# EAGLE schematic Main 4000 Model REV1A (EAGLE 7.4.0)

## Sheet 1 of 4: PWR
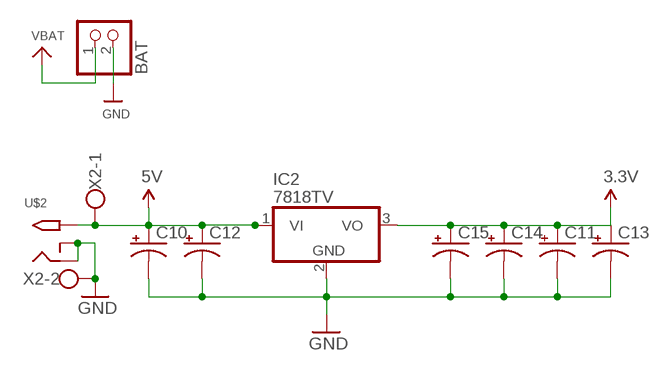
[diagram p0: schematic, sheet 1]

### Parts
BAT  JST_2PIN-SMT-RA  [JST-PH-2-SMT-RA]
C10  CPOL-USE2.5-6  [E2,5-6]
C11  CPOL-USE1.8-4  [E1,8-4]
C12  CPOL-USE1.8-4  [E1,8-4]
C13  CPOL-USE2.5-6  [E2,5-6]
C14  CPOL-USE1.8-4  [E1,8-4]
C15  CPOL-USE1.8-4  [E1,8-4]
IC2  7818TV  [TO220V]
U$2  2.1MMJACKTHM  [PJ-102A]
X2  W237-102  [W237-102]

### Nets
3.3V: C11.+ C13.+ C14.+ C15.+ IC2.3(VO) ; also sheet 2,3,4
5V: C10.+ C12.+ IC2.1(VI) U$2.TIP X2.1 ; also sheet 2,3,4
GND: BAT.2 C10.- C11.- C12.- C13.- C14.- C15.- IC2.2(GND) U$2.RING U$2.RING_SW X2.2 ; also sheet 2,3,4
VBAT: BAT.1 ; also sheet 2,3,4

## Sheet 2 of 4: Connectors and Coms
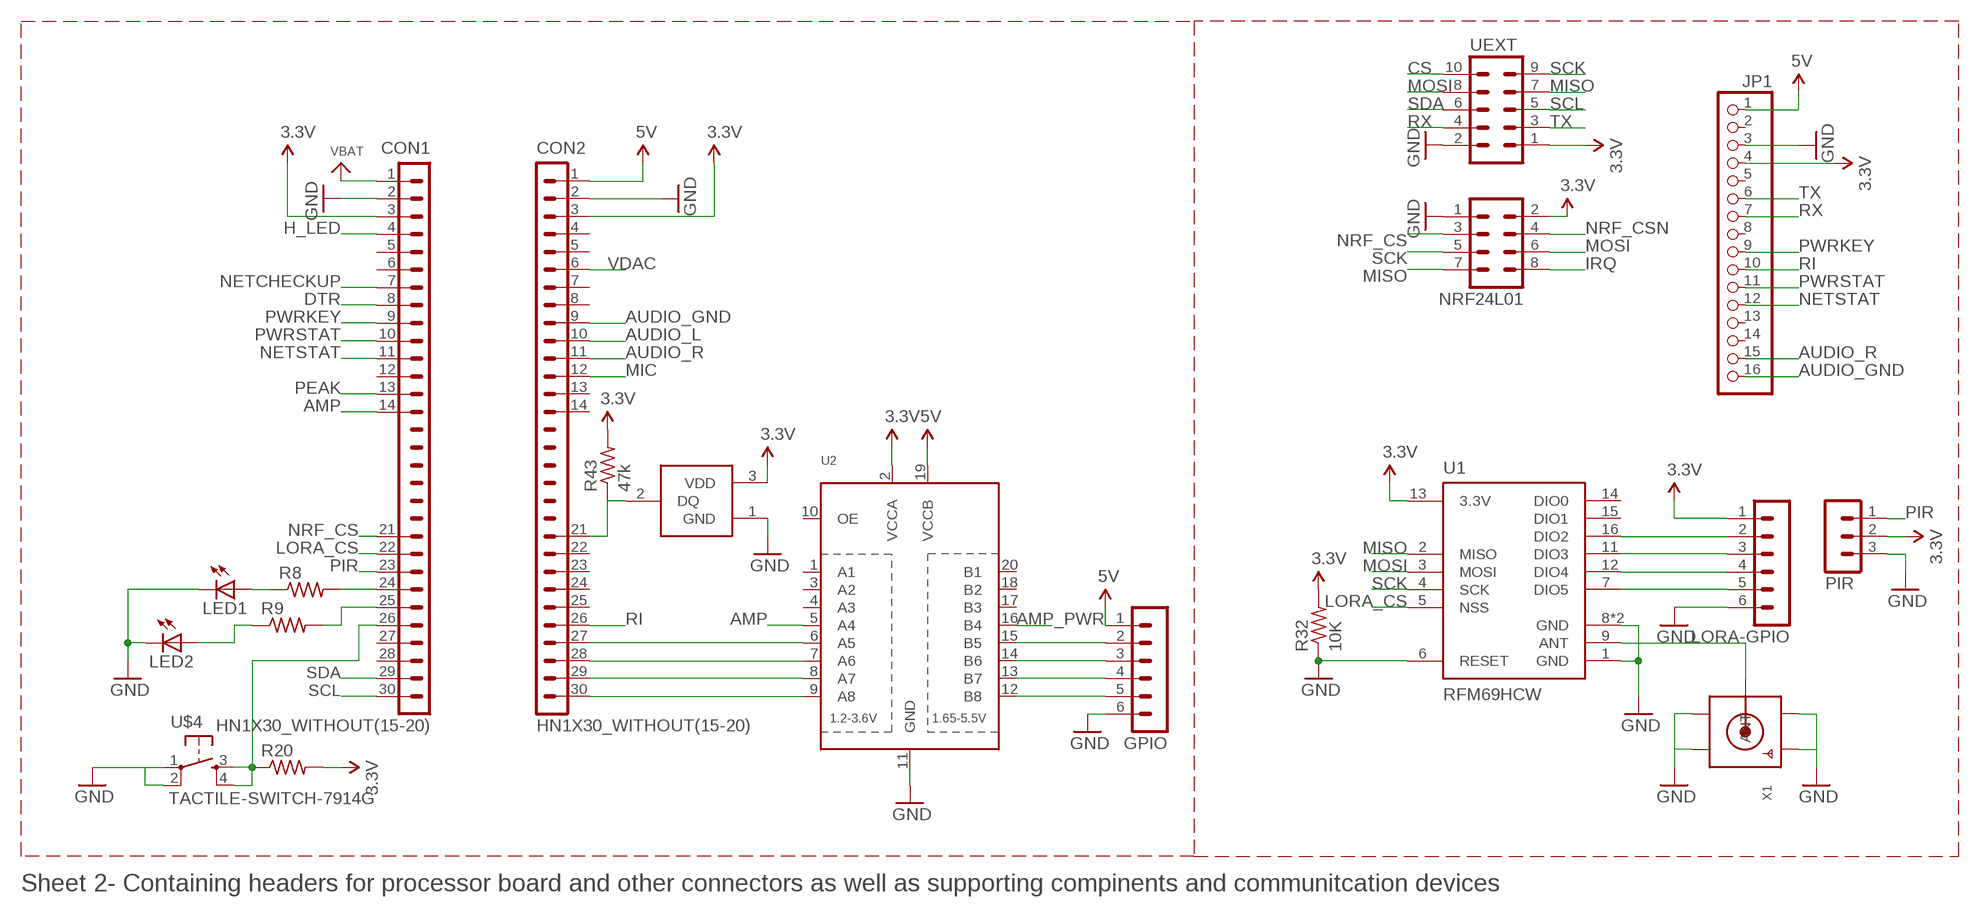
[diagram p1: schematic, sheet 2]

### Parts
CON1  HN1X30_WITHOUT(15-20)  CON30_WITHOUT(15-20)  [HN1X30_WITHOUT(15-20)]
CON2  HN1X30_WITHOUT(15-20)  CON30_WITHOUT(15-20)  [HN1X30_WITHOUT(15-20)]
GPIO  MA06-1  [MA06-1]
JP1  PINHD-1X16  [1X16]
LED1  LED5MM  [LED5MM]
LED2  LED5MM  [LED5MM]
LORA-GPIO  MA06-1  [MA06-1]
NRF24L01  MA04-2  [MA04-2]
PIR  MA03-1  [MA03-1]
R8  R-US_R0805  [R0805]
R9  R-US_R0805  [R0805]
R20  R-US_R0805  [R0805]
R32  10K  R-US_R0805  [R0805]
R43  47k  R-US_R0805  [R0805]
U1  RFM69HCW  [RFM69HCW-XXXS2]
U2  TXB0108PWR  [TSSOP20]
U$4  TACTILE-SWITCH-7914G  [7914G]
U$11  DS18B20Z  [TO92]
UEXT  MA05-2  [MA05-2]
X1  SMACONNECTOR_EDGE  [SMA_EDGELAUNCH]

### Nets
3.3V: CON1.3 CON2.3 JP1.4 LORA-GPIO.1 NRF24L01.2 PIR.2 R20.2 R32.2 R43.2 U1.13(3.3V) U2.2(VCCA) U$11.3(VDD) UEXT.1 ; also sheet 1,3,4
5V: CON2.1 GPIO.1 JP1.1 U2.19(VCCB) ; also sheet 1,3,4
AMP: CON1.14 U2.5(A4)
AMP_PWR: U2.16(B4) ; also sheet 3
AUDIO_GND: CON2.9 JP1.16 ; also sheet 3
AUDIO_L: CON2.10 ; also sheet 3
AUDIO_R: CON2.11 JP1.15 ; also sheet 3
CS: UEXT.10
DTR: CON1.8
GND: CON1.2 CON2.2 GPIO.6 JP1.3 LED1.K(C) LED2.K(C) LORA-GPIO.6 NRF24L01.1 PIR.3 R32.1 U1.1(GND) U1.6(RESET) U1.8(GND) U1.10(GND) U2.11(GND) U$4.1 U$4.2 U$11.1(GND) UEXT.2 X1.GND@1(GND4) X1.GND@2(GND3) X1.GND@3(GND2) X1.GND@4(GND1) ; also sheet 1,3,4
H_LED: CON1.4 ; also sheet 3
IRQ: NRF24L01.8
LORA_CS: CON1.22 U1.5(NSS)
MIC: CON2.12 ; also sheet 3
MISO: NRF24L01.7 U1.2(MISO) UEXT.7
MOSI: NRF24L01.6 U1.3(MOSI) UEXT.8
N$1: LORA-GPIO.5 U1.7(DIO5)
N$2: U1.9(ANT) X1.P(ANT)
N$3: LORA-GPIO.4 U1.12(DIO4)
N$4: LORA-GPIO.3 U1.11(DIO3)
N$5: LORA-GPIO.2 U1.16(DIO2)
N$15: LED2.A R9.1
N$16: CON2.30 U2.9(A8)
N$17: CON2.29 U2.8(A7)
N$18: CON2.28 U2.7(A6)
N$19: CON2.27 U2.6(A5)
N$43: LED1.A R8.1
N$44: CON1.24 R8.2
N$45: CON1.25 R9.2
N$59: CON1.26 R20.1 U$4.3 U$4.4
N$64: GPIO.2 U2.15(B5)
N$65: GPIO.3 U2.14(B6)
N$66: GPIO.4 U2.13(B7)
N$67: GPIO.5 U2.12(B8)
N$149: CON2.21 R43.1 U$11.2(DQ)
NETCHECKUP: CON1.7
NETSTAT: CON1.11 JP1.12
NRF_CS: CON1.21 NRF24L01.3
NRF_CSN: NRF24L01.4
PEAK: CON1.13 ; also sheet 3
PIR: CON1.23 PIR.1
PWRKEY: CON1.9 JP1.9
PWRSTAT: CON1.10 JP1.11
RI: CON2.26 JP1.10
RX: JP1.7 UEXT.4
SCK: NRF24L01.5 U1.4(SCK) UEXT.9
SCL: CON1.30 UEXT.5 ; also sheet 3,4
SDA: CON1.29 UEXT.6 ; also sheet 3,4
TX: JP1.6 UEXT.3
VBAT: CON1.1 ; also sheet 1,3,4
VDAC: CON2.6 ; also sheet 3
Unconnected: CON1.5 CON1.6 CON1.12 CON1.27 CON1.28 CON2.4 CON2.5 CON2.7 CON2.8 CON2.13 CON2.14 CON2.22 CON2.23 CON2.24 CON2.25 JP1.2 JP1.5 JP1.8 JP1.13 JP1.14 U1.14(DIO0) U1.15(DIO1) U2.1(A1) U2.3(A2) U2.4(A3) U2.10(OE) U2.17(B3) U2.18(B2) U2.20(B1)

### Notes on the sheet
- Sheet 2- Containing headers for processor board and other connectors as well as supporting compinents and communitcation devices

## Sheet 3 of 4: Analog Components
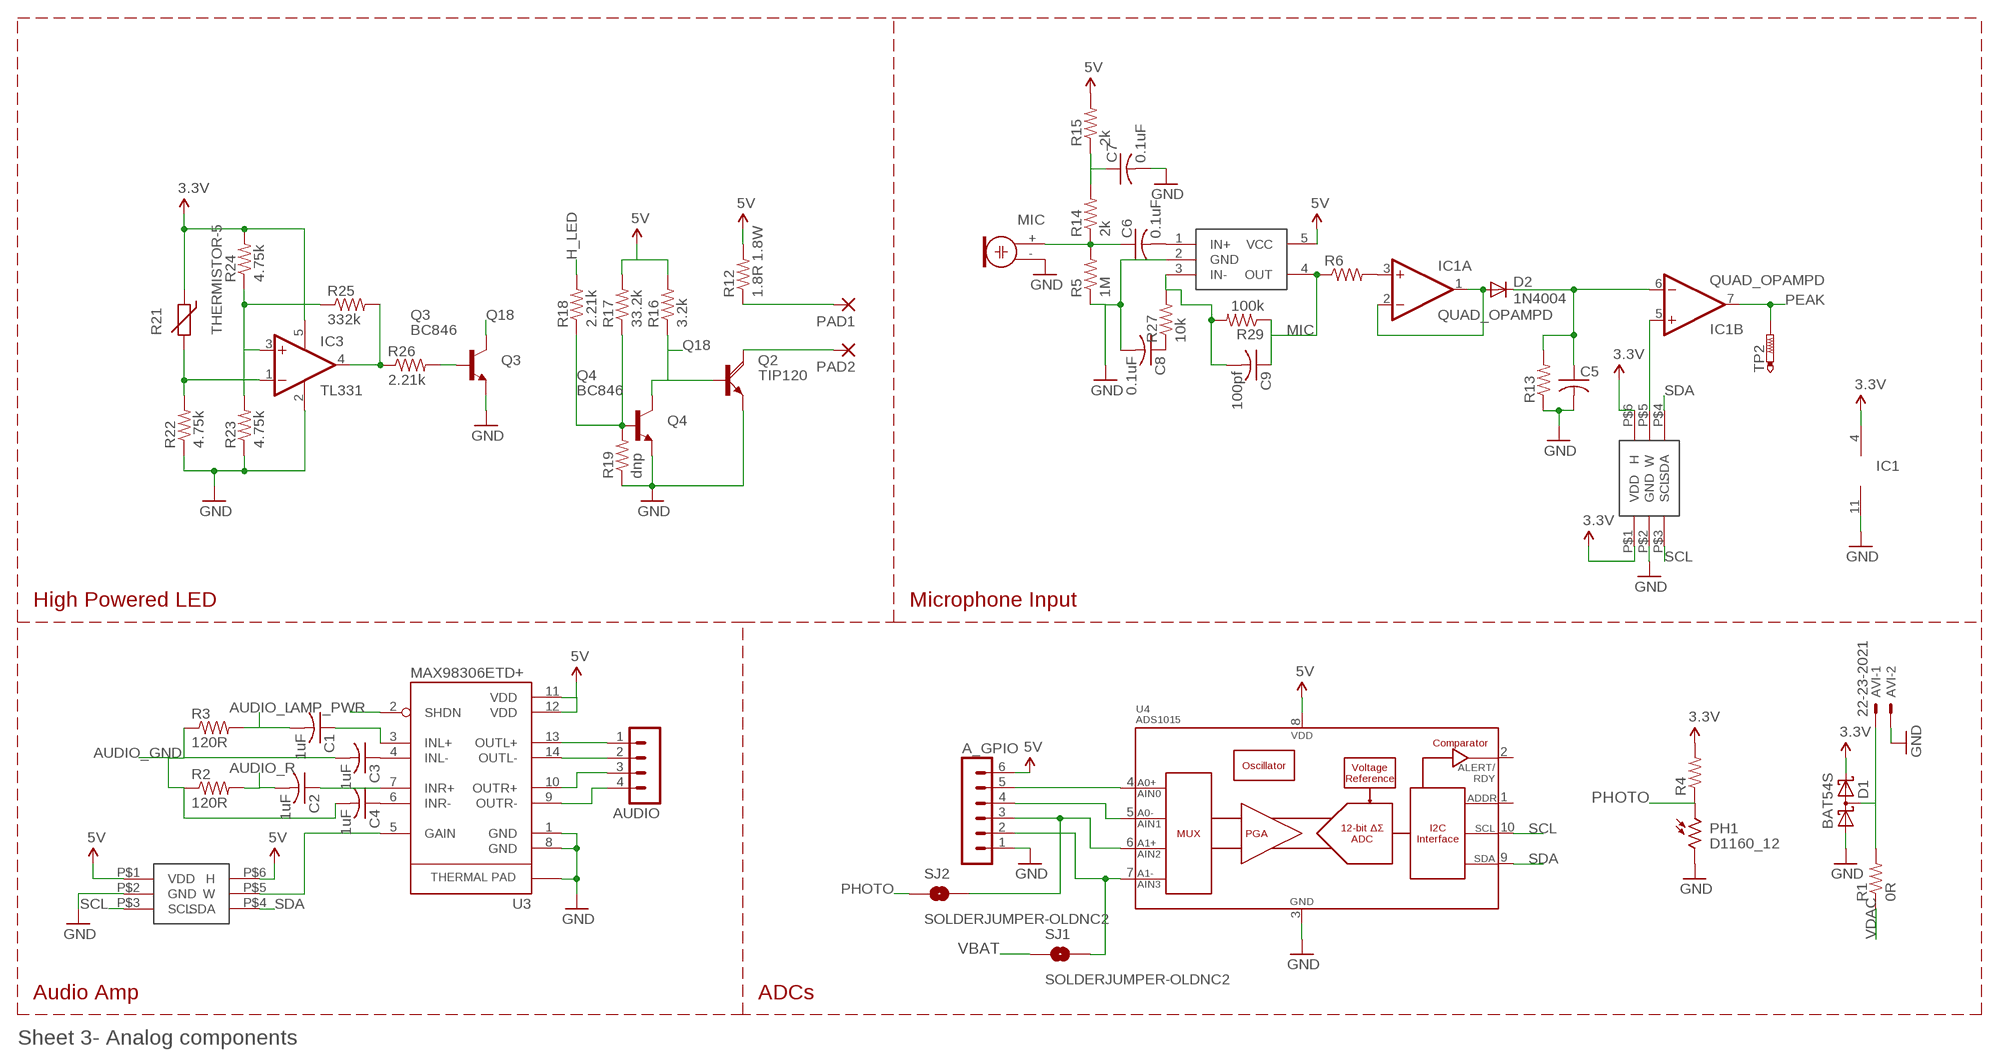
[diagram p2: schematic, sheet 3]

### Parts
A_GPIO  MA06-1  [MA06-1]
AUDIO  MA04-1  [MA04-1]
AVI  22-23-2021  [22-23-2021]
C1  1uF  C-USC0805  [C0805]
C2  1uF  C-USC0805  [C0805]
C3  1uF  C-USC0805  [C0805]
C4  1uF  C-USC0805  [C0805]
C5  C-USC0805K  [C0805K]
C6  0.1uF  C-USC0805  [C0805]
C7  0.1uF  C-USC0805  [C0805]
C8  0.1uF  C-USC0805  [C0805]
C9  100pf  C-USC0805  [C0805]
D1  BAT54S  [SOT23]
D2  1N4004  [DO41-10]
IC1  QUAD_OPAMPD  [SO14]
IC3  TL331  [DBV-R-PDSO-G5]
MIC  ELECTRET  [9.7ELECTRET]
PAD1  3,81/1,4  [3,81/1,4]
PAD2  3,81/1,4  [3,81/1,4]
PH1  D1160_12  [D11XX]
Q2  TIP120  [TO220AH]
Q3  BC846  [SOT23]
Q4  BC846  [SOT23]
R1  0R  R-US_R0805  [R0805]
R2  120R  R-US_R0805  [R0805]
R3  120R  R-US_R0805  [R0805]
R4  R-US_R0805  [R0805]
R5  1M  R-US_R0805  [R0805]
R6  R-US_R0805  [R0805]
R12  1.8R 1.8W  R-US_VMTB60  [VMTB60]
R13  R-US_R0805  [R0805]
R14  2k  R-US_R0805  [R0805]
R15  2k  R-US_R0805  [R0805]
R16  3.2k  R-US_R0805  [R0805]
R17  33.2k  R-US_R0805  [R0805]
R18  2.21k  R-US_R0805  [R0805]
R19  dnp  R-US_R0805  [R0805]
R21  THERMISTOR-5  [R-5]
R22  4.75k  R-US_R0805  [R0805]
R23  4.75k  R-US_R0805  [R0805]
R24  4.75k  R-US_R0805  [R0805]
R25  332k  R-US_R0805  [R0805]
R26  2.21k  R-US_R0805  [R0805]
R27  10k  R-US_R0805  [R0805]
R29  100k  R-US_R0805  [R0805]
SJ1  SOLDERJUMPER-OLDNC2  [SJ_2S-NOTRACE]
SJ2  SOLDERJUMPER-OLDNC2  [SJ_2S-NOTRACE]
TP2  PTR1PAD1-13  [P1-13]
U3  MAX98306ETD+  [14-TDFN]
U4  ADS1015  [MSOP10]
U$1  TPL0401A/B  [SC-70]
U$3  MAX4466  [SOT23-5L]
U$5  TPL0401A/B  [SC-70]

### Nets
3.3V: D1.2(C2) IC1.4(P:V+) IC3.5(V+) R4.2 R21.1 R24.2 U$5.P$1(VDD) U$5.P$6(H) ; also sheet 1,2,4
5V: A_GPIO.6 R12.2 R15.2 R16.2 R17.2 U3.11(VDD) U3.12(VDD) U4.8(VDD) U$1.P$1(VDD) U$1.P$6(H) U$3.5(VCC) ; also sheet 1,2,4
AMP_PWR: U3.2(SHDN) ; also sheet 2
AUDIO_GND: C3.2 C4.2 R2.1 R3.1 ; also sheet 2
AUDIO_L: C1.2 R3.2 ; also sheet 2
AUDIO_R: C2.2 R2.2 ; also sheet 2
GND: A_GPIO.1 AVI.2 C5.2 C7.2 C8.2 D1.1(A1) IC1.11(P:V-) IC3.2(GND) MIC.- PH1.2 Q2.E Q3.2(E) Q4.2(E) R5.1 R13.1 R19.1 R22.1 R23.1 U3.1(GND) U3.8(GND) U3.15(GND) U4.3(VSS) U$1.P$2(GND) U$3.2(GND) U$5.P$2(GND) ; also sheet 1,2,4
H_LED: R18.2 ; also sheet 2
MIC: C9.1 R6.1 R29.1 U$3.4(OUT) ; also sheet 2
N$6: C5.1 D2.C IC1.6(B:-IN) R13.2
N$9: C6.1 MIC.+ R5.2 R14.1
N$10: IC1.5(B:+IN) U$5.P$5(W)
N$13: C1.1 U3.3(INL+)
N$14: AVI.1 D1.3(C1A2) R1.2
N$24: C2.1 U3.7(INR+)
N$25: C3.1 U3.4(INL-)
N$26: C4.1 U3.6(INR-)
N$27: A_GPIO.5 U4.4(AIN0)
N$28: A_GPIO.4 U4.5(AIN1)
N$29: A_GPIO.3 SJ2.2 U4.6(AIN2)
N$30: A_GPIO.2 SJ1.2 U4.7(AIN3)
N$35: IC1.3(A:+IN) R6.2
N$38: D2.A IC1.1(A:OUT) IC1.2(A:-IN)
N$39: AUDIO.4 U3.9(OUTR-)
N$40: AUDIO.3 U3.10(OUTR+)
N$41: AUDIO.2 U3.14(OUTL-)
N$42: AUDIO.1 U3.13(OUTL+)
N$46: C6.2 U$3.1(IN+)
N$49: C7.1 R14.2 R15.1
N$50: U3.5(GAIN) U$1.P$5(W)
N$51: PAD2.1(P) Q2.C
N$52: PAD1.1(P) R12.1
N$53: C8.1 R27.1
N$54: Q4.1(B) R17.1 R18.1 R19.2
N$56: IC3.1(-IN) R21.2 R22.2
N$58: IC3.3(+IN) R23.2 R24.1 R25.1
N$61: IC3.4(OUT) R25.2 R26.1
N$62: Q3.1(B) R26.2
N$69: C9.2 R27.2 R29.2 U$3.3(IN-)
PEAK: IC1.7(B:OUT) TP2.TP ; also sheet 2
PHOTO: PH1.1 R4.1 SJ2.1 ; also sheet 4
Q18: Q2.B Q3.3(C) Q4.3(C) R16.1
SCL: U4.10(SCL) U$1.P$3(SCL) U$5.P$3(SCL) ; also sheet 2,4
SDA: U4.9(SDA) U$1.P$4(SDA) U$5.P$4(SDA) ; also sheet 2,4
VBAT: SJ1.1 ; also sheet 1,2,4
VDAC: R1.1 ; also sheet 2
Unconnected: IC1.8(C:OUT) IC1.9(C:-IN) IC1.10(C:+IN) IC1.12(D:+IN) IC1.13(D:-IN) IC1.14(D:OUT) U4.1(ADDR) U4.2(ALERT/RDY)

### Notes on the sheet
- Q3
- Q4
- IC1
- High Powered LED | Microphone Input
- Audio Amp | ADCs
- Sheet 3- Analog components

## Sheet 4 of 4
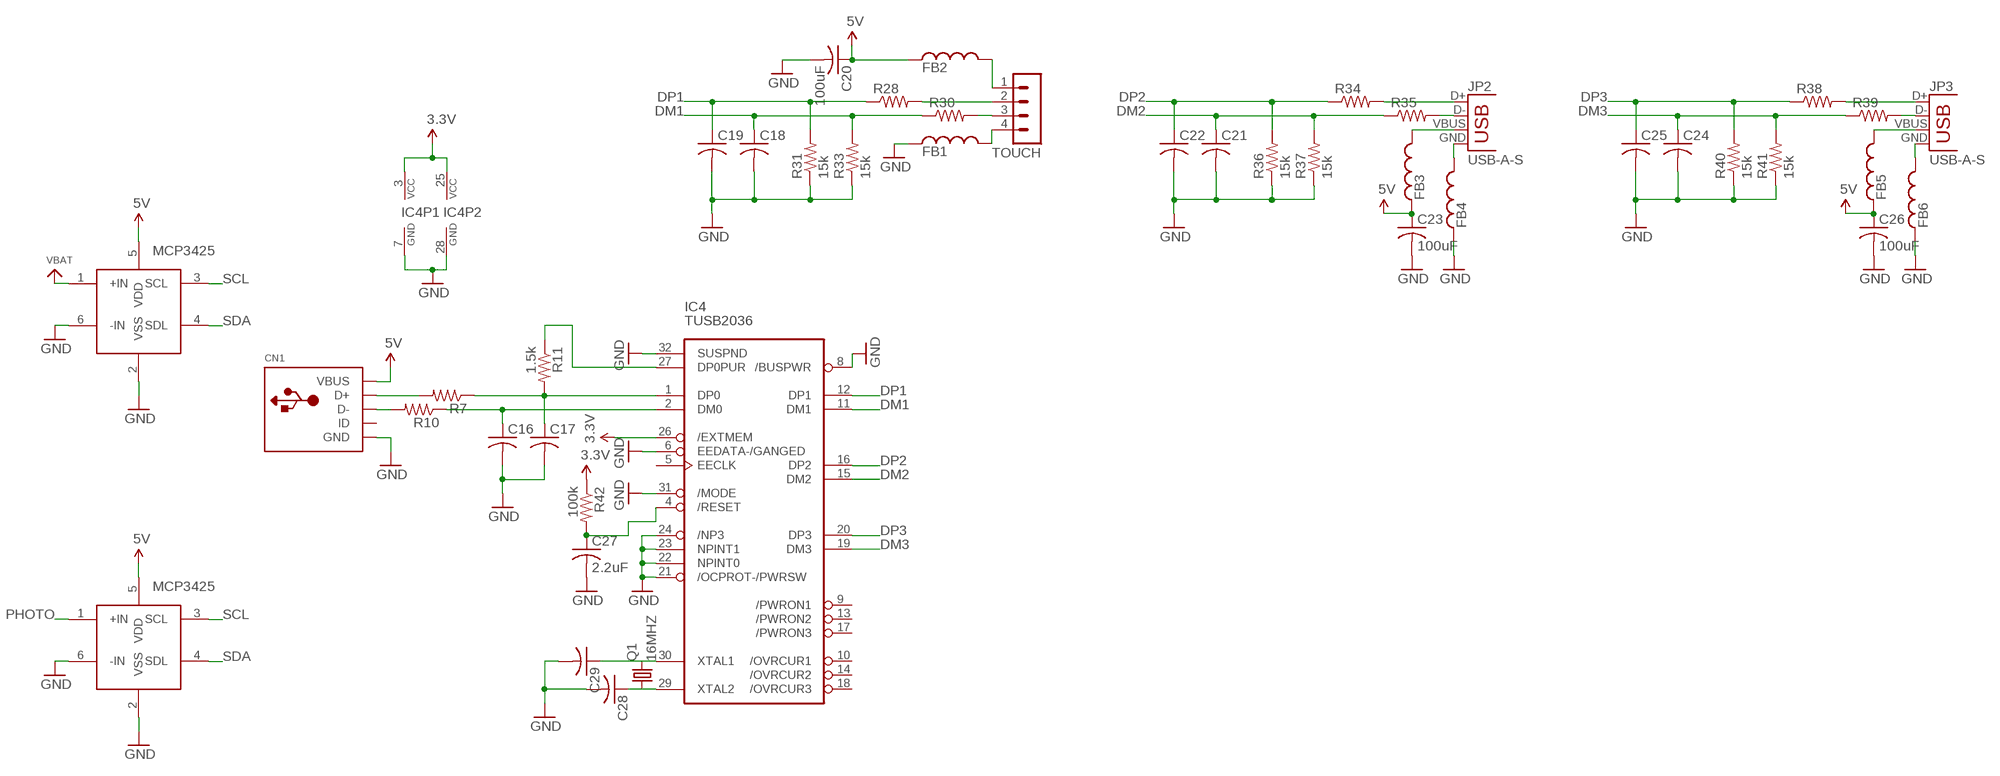
[diagram p3: schematic, sheet 4]

### Parts
C16  C-USC0805  [C0805]
C17  C-USC0805  [C0805]
C18  C-USC0805  [C0805]
C19  C-USC0805  [C0805]
C20  100uF  C-USC0805  [C0805]
C21  C-USC0805  [C0805]
C22  C-USC0805  [C0805]
C23  100uF  C-USC0805  [C0805]
C24  C-USC0805  [C0805]
C25  C-USC0805  [C0805]
C26  100uF  C-USC0805  [C0805]
C27  2.2uF  C-USC0805  [C0805]
C28  C-USC0805  [C0805]
C29  C-USC0805  [C0805]
CN1  USBMOLEX  [USB-MINIB-THM-MOLEX]
FB1  FB1206  [FB1206]
FB2  FB1206  [FB1206]
FB3  FB1206  [FB1206]
FB4  FB1206  [FB1206]
FB5  FB1206  [FB1206]
FB6  FB1206  [FB1206]
IC4  TUSB2036  [LQFP32]
JP2  USB-A-S  [USB-A-S]
JP3  USB-A-S  [USB-A-S]
Q1  16MHZ  CRYSTALHC49UP  [HC49UP]
R7  R-US_R0805  [R0805]
R10  R-US_R0805  [R0805]
R11  1.5k  R-US_R0805  [R0805]
R28  R-US_R0805  [R0805]
R30  R-US_R0805  [R0805]
R31  15k  R-US_R0805  [R0805]
R33  15k  R-US_R0805  [R0805]
R34  R-US_R0805  [R0805]
R35  R-US_R0805  [R0805]
R36  15k  R-US_R0805  [R0805]
R37  15k  R-US_R0805  [R0805]
R38  R-US_R0805  [R0805]
R39  R-US_R0805  [R0805]
R40  15k  R-US_R0805  [R0805]
R41  15k  R-US_R0805  [R0805]
R42  100k  R-US_R0805  [R0805]
TOUCH  MA04-1  [MA04-1]
U$6  MCP3425SOT  [SOT23-6]
U$8  MCP3425SOT  [SOT23-6]

### Nets
3.3V: IC4.3(VCC) IC4.25(VCC) IC4.26(/EXTMEM) R42.1 ; also sheet 1,2,3
5V: C20.1 C23.1 C26.1 CN1.VBUS FB2.1 FB3.1 FB5.1 U$6.5(VDD) U$8.5(VDD) ; also sheet 1,2,3
DM1: C18.1 IC4.11(DM1) R30.1 R33.2
DM2: C21.1 IC4.15(DM2) R35.1 R37.2
DM3: C24.1 IC4.19(DM3) R39.1 R41.2
DP1: C19.1 IC4.12(DP1) R28.1 R31.2
DP2: C22.1 IC4.16(DP2) R34.1 R36.2
DP3: C25.1 IC4.20(DP3) R38.1 R40.2
GND: C16.2 C17.2 C18.2 C19.2 C20.2 C21.2 C22.2 C23.2 C24.2 C25.2 C26.2 C27.2 C28.2 C29.2 CN1.GND FB1.1 FB4.1 FB6.1 IC4.6(EEDATA-/GANGED) IC4.7(GND) IC4.8(/BUSPWR) IC4.21(/OCPROT-/PWRSW) IC4.22(NPINT0) IC4.23(NPINT1) IC4.24(/NP3) IC4.28(GND) IC4.31(/MODE) IC4.32(SUSPND) R31.1 R33.1 R36.1 R37.1 R40.1 R41.1 U$6.2(VSS) U$6.6(-IN) U$8.2(VSS) U$8.6(-IN) ; also sheet 1,2,3
N$11: R30.2 TOUCH.3
N$12: JP2.D- R35.2
N$31: CN1.D- R10.2
N$102: CN1.D+ R7.2
N$103: C17.1 IC4.1(DP0) R7.1 R11.2
N$104: C16.1 IC4.2(DM0) R10.1
N$105: IC4.27(DP0PUR) R11.1
N$106: JP2.D+ R34.2
N$107: R28.2 TOUCH.2
N$108: FB2.2 TOUCH.1
N$109: FB1.2 TOUCH.4
N$110: FB3.2 JP2.VBUS
N$111: FB4.2 JP2.GND
N$112: JP3.D- R39.2
N$113: JP3.D+ R38.2
N$114: FB5.2 JP3.VBUS
N$115: FB6.2 JP3.GND
N$116: C29.1 IC4.30(XTAL1) Q1.2
N$117: C28.1 IC4.29(XTAL2) Q1.1
N$118: C27.1 IC4.4(/RESET) R42.2
PHOTO: U$6.1(+IN) ; also sheet 3
SCL: U$6.3(SCL) U$8.3(SCL) ; also sheet 2,3
SDA: U$6.4(SDL) U$8.4(SDL) ; also sheet 2,3
VBAT: U$8.1(+IN) ; also sheet 1,2,3
Unconnected: CN1.ID IC4.5(EECLK) IC4.9(/PWRON1) IC4.10(/OVRCUR1) IC4.13(/PWRON2) IC4.14(/OVRCUR2) IC4.17(/PWRON3) IC4.18(/OVRCUR3)

## Library data of the parts
A_GPIO GPIO LORA-GPIO = con-lstb:MA06-1: PIN HEADER; OC_FARNELL: unknown; OC_NEWARK: unknown
AUDIO TOUCH = con-lstb:MA04-1: PIN HEADER; OC_FARNELL: unknown; OC_NEWARK: unknown
AVI = con-molex:22-23-2021: .100" (2.54mm) Center Header - 2 Pin; MF: MOLEX; MPN: 22-23-2021; OC_FARNELL: 1462926; OC_NEWARK: 25C3832
BAT = adafruit:JST_2PIN: JST 2-Pin Connectors of various flavors SMT-RA (S2B-PH-SM4) 4UConnector #17311 SMT (B2B-PH-SM4) THM-RA (S2B-PH) THM (B2B-PH)
C1-C9 C16-C29 = rcl:C-US: CAPACITOR, American symbol
C10-C15 = rcl:CPOL-US: POLARIZED CAPACITOR, American symbol
CN1 = adafruit:USB: USB Connectors USBMINIB - Surface Mount Female Mini-B USB Connector 4UConnector: 06564 By microbuilder.eu Thru-hole RA Female Mini-B USB Connector 4UConnector: 18732 By ladyada.net
CON1 CON2 = Penko:CON30_WITHOUT(15-20)
D1 = diode:BAT54S: Schottky Diodes Pin connection corrected 2011-05-04 Source: Fairchild .. BAT54.pdf
D2 = adafruit:1N4004: DIODE General purpose 1N400x type rectifier (With bigger pads) http://www.ladyada.net/library/pcb/eaglelibrary.html
FB1-FB6 = ELL-i-Passives:FB: Ferrite beads Ferrite beads are choke coils used to suppress high frequency noise in electronic circuits. Wikipedia article on ferrite beads <https://en.wikipedia.org/wiki/Ferrite_bead>
IC1 = adafruit:QUAD_OPAMP: OP AMP Standard quad package
IC2 = linear:78*: Positive VOLTAGE REGULATOR Source: http://cache.national.com/ds/LM/LM78L05.pdf http://www.fairchildsemi.com/ds/LM/LM7805.pdf
IC3 = linear:TL331: SINGLE DIFFERENTIAL COMPARATOR Source: Data sheet <http://www.ti.com/lit/ds/symlink/tl331-q1.pdf>
IC4 = newchips:TUSB2036: 2/3-Port USB hub
JP1 = pinhead:PINHD-1X16: PIN HEADER
JP2 JP3 = SparkFun-Connectors:USB: USB Connectors USB-B-PTH is fully proven SKU : PRT-00139/CONN-08278 USB-miniB is fully proven SKU : PRT-00587 USB-A-PCB is untested. USB-A-H is throughly reviewed, but untested. Spark Fun Electronics SKU : PRT-00437 USB-B-SMT is throughly reviewed, but untested. Needs silkscreen touching up. USB-A-S has not been used/tested USB-MB-H has not been used/tested USB-MICROB has been used. CONN-09505
LED1 LED2 = adafruit:LED: LED OSRAM: - CHIPLED LG R971, LG N971, LY N971, LG Q971, LY Q971, LO R971, LY R971 LH N974, LH R974 LS Q976, LO Q976, LY Q976 LO Q996 - Hyper CHIPLED LW Q18S LB Q993, LB Q99A, LB R99A - SideLED LS A670, LO A670, LY A670, LG A670, LP A670 LB A673, LV A673, LT A673, LW A673 LH A674 LY A675 LS A676, LA A676, LO A676, LY A676, LW A676 LS A679, LY A679, LG A679 - Hyper Micro SIDELED® LS Y876, LA Y876, LO Y876, LY Y876 LT Y87S - SmartLED LW L88C, LW L88S LB L89C, LB L89S, LG L890 LS L89K, LO L89K, LY L89K LS L896, LA L896, LO L896, LY L896 - TOPLED LS T670, LO T670, LY T670, LG T670, LP T670 LSG T670, LSP T670, LSY T670, LOP T670, LYG T670 LG T671, LOG T671, LSG T671 LB T673, LV T673, LT T673, LW T673 LH T674 LS T676, LA T676, LO T676, LY T676, LB T676, LH T676, LSB T676, LW T676 LB T67C, LV T67C, LT T67C, LS T67K, LO T67K, LY T67K, LW E67C LS E67B, LA E67B, LO E67B, LY E67B, LB E67C, LV E67C, LT E67C LW T67C LS T679, LY T679, LG T679 LS T770, LO T770, LY T770, LG T770, LP T770 LB T773, LV T773, LT T773, LW T773 LH T774 LS E675, LA E675, LY E675, LS T675 LS T776, LA T776, LO T776, LY T776, LB T776 LHGB T686 LT T68C, LB T68C - Hyper Mini TOPLED® LB M676 - Mini TOPLED Santana® LG M470 LS M47K, LO M47K, LY M47K Source: http://www.osram.convergy.de/
MIC = adafruit:ELECTRET: Electret microphone Thru hole 2.54mm spacing with 9.7mm diameter
NRF24L01 = con-lstb:MA04-2: PIN HEADER; OC_FARNELL: unknown; OC_NEWARK: unknown
PAD1 PAD2 = wirepad:3,81/1,4: THROUGH-HOLE PAD
PH1 = photo-elements:D11: Photo Sensor Oil Burner Control Applications Source: http://optoelectronics.perkinelmer.com/content/Datasheets/DTS_PhotocellsD1160.pdf
PIR = con-lstb:MA03-1: PIN HEADER; OC_FARNELL: unknown; OC_NEWARK: unknown
Q1 = adafruit:CRYSTAL: CRYSTAL; OC_FARNELL: unknown; OC_NEWARK: unknown
Q2 = transistor-power:TIP120: NPN DARLINGTON TRANSISTOR
Q3 Q4 = transistor:BC846: NPN TRANSISTOR
R1-R20 R22-R43 = rcl:R-US_: RESISTOR, American symbol
R21 = varistor:THERMISTOR: THERMISTOR
SJ1 SJ2 = SparkFun-Retired:SOLDERJUMPER-OLD: Solder Jumper Standard SMD solder jumper. Used to automate production. Two varients : Normally Open and Normally Closed are the same, but have different paste layers. NC will have a large amount of paste and should jumper during reflow.
TP2 = testpad:PTR1: TEST PIN
U1 = SparkFun-RF:RFM69H
U2 = adafruit:TXB0108PWR: 8-Bit Bi-Directional Level Shifter 1.2V-3.6V (VCCA) to 1.65V-5.5V (VCCB) bi-directional level shifter with auto direction sensing. Max data rate - VCCA 1.8V: 20Mbps (50ns), VCCA 3.3V: 100Mbps (10ns) Digikey: 296-21527-1-ND
U3 = SparkFun-PowerIC:MAX98306: Stereo 3.7W Class D Amplifier Datasheet: http://datasheets.maxim-ic.com/en/ds/MAX98306.pdf The MAX98306 stereo 3.7W Class D amplifier provides Class AB audio performance with Class D efficiency. This device offers five selectable gain settings (6dB, 9dB, 12dB, 15dB, and 18dB) set by a single gain-select input (GAIN). Active emissions limiting, edge-rate, and overshoot control circuitry combined with a filterless spread-spectrum modulation scheme (SSM) provide excellent EMI performance while eliminating the need for output filtering found in traditional Class D devices. These features reduce application component count. The IC's 2.0mA quiescent current with a 3.7V supply extends battery life in portable applications. The IC is available in a 14-pin TDFN (3mm x 3mm x 0.75mm) package specified over the extended -40NC to +85NC temperature range.
U4 = SparkFun-AnalogIC:ADS1015: 12-Bit Del-Sig ADC Four single-ended inputs or two differential inputs Internal PGA I2C interface 2.0-5.5V; PROD_ID: IC-12239
U$1 U$5 = adafruit:TPL0401A/B
U$2 = adafruit:2.1MMJACK: 2.1mm x 5.5mm THM DC jack with internal switch. Digikey part #PJ-102A, 4UCON part #05537 2.1mm x 5.5mm SMT DC jack with internal switch. Digikey part #PJ-002A-SMT, 4UCON part #03267 By microbuilder.eu & adafruit.com
U$3 = adafruit:MAX4466
U$4 = GeekAmmo:TACTILE-SWITCH: Tactile Switch 4 Pins, SPST NO
U$6 U$8 = adafruit:MCP3425
U$11 = adafruit:DS18B20Z
UEXT = con-lstb:MA05-2: PIN HEADER; OC_FARNELL: unknown; OC_NEWARK: unknown
X1 = adafruit:SMACONNECTOR: SMA Connector 90° DIP SMA Connector, 50 Ohm (4UConnector: 07259)
X2 = con-wago-500:W237-102: WAGO SCREW CLAMP; MPN: 237-102; OC_FARNELL: unknown; OC_NEWARK: 70K9898